# EAGLE design Lux_5V Compatable (EAGLE 8.1.1)
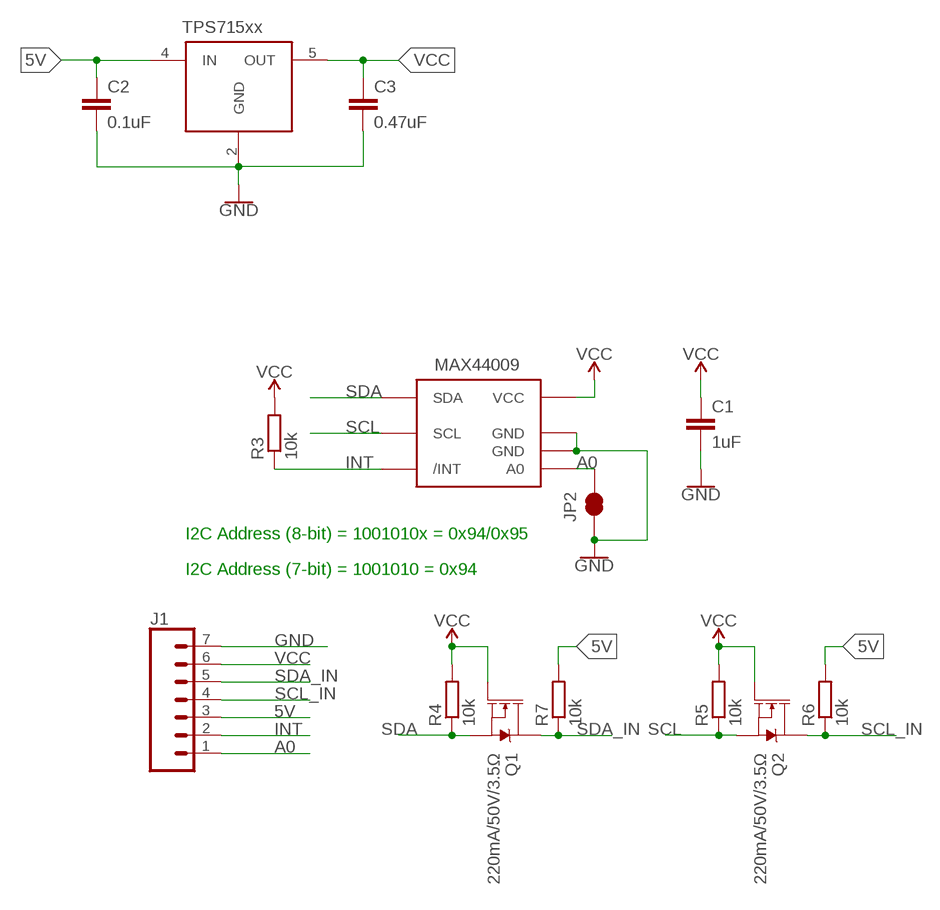
[diagram p0: schematic, sheet 1]

## Parts
C1  1uF  C-EUC0603  [C0603]
C2  0.1uF  C-EUC0603  [C0603]
C3  0.47uF  C-EUC0603  [C0603]
J1  CONN_07  [1X07]
JP2  JUMPER-SMT_2_NC_TRACE_SILK  [SMT-JUMPER_2_NC_TRACE_SILK]
Q1  220mA/50V/3.5Ω  MOSFET-NCH-BSS138  [SOT23-3]
Q2  220mA/50V/3.5Ω  MOSFET-NCH-BSS138  [SOT23-3]
R3  10k  R-EU_R0603  [R0603]
R4  10k  R-EU_R0603  [R0603]
R5  10k  R-EU_R0603  [R0603]
R6  10k  R-EU_R0603  [R0603]
R7  10k  R-EU_R0603  [R0603]
U$1  MAX44009  [UTDFN6]
U$2  TPS715XX  [DCK_R-PDSO-G5]

## Nets
5V: C2.1 J1.3 R6.2 R7.2 U$2.4(IN)
A0: J1.1 JP2.2 U$1.P$3(A0)
GND: C1.2 C2.2 C3.2 J1.7 JP2.1 U$1.P$2(GND) U$1.P$7(GND) U$2.2(GND)
INT: J1.2 R3.1 U$1.P$4(/INT)
SCL: Q2.2(S) R5.1 U$1.P$5(SCL)
SCL_IN: J1.4 Q2.3(D) R6.1
SDA: Q1.2(S) R4.1 U$1.P$6(SDA)
SDA_IN: J1.5 Q1.3(D) R7.1
VCC: C1.1 C3.1 J1.6 Q1.1(G) Q2.1(G) R3.2 R4.2 R5.2 U$1.P$1(VCC) U$2.5(OUT)

## Notes on the sheet
- I2C Address (8-bit) = 1001010x = 0x94/0x95
- I2C Address (7-bit) = 1001010 = 0x94

## Library data of the parts
C1-C3 = rcl:C-EU: CAPACITOR, European symbol
J1 = SparkFun-Connectors:CONN_07: Multi connection point. Often used as Generic Header-pin footprint for 0.1 inch spaced/style header connections On any of the 0.1 inch spaced packages, you can populate with these: Break Away Headers - Straight <https://www.sparkfun.com/products/116> (PRT-00116) Break Away Male Headers - Right Angle <https://www.sparkfun.com/products/553> (PRT-00553) Female Headers <https://www.sparkfun.com/products/115> (PRT-00115) Break Away Headers - Machine Pin <https://www.sparkfun.com/products/117> (PRT-00117) Break Away Female Headers - Swiss Machine Pin <https://www.sparkfun.com/products/743> (PRT-00743) For SCREWTERMINALS and SPRING TERMINALS visit here: Screw Terimnals on SparkFun.com <https://www.sparkfun.com/search/results?term=Screw+Terminals> (5mm/3.5mm/2.54mm spacing) This device is also useful as a general connection point to wire up your design to another part of your project. Our various solder wires solder well into these plated through hole pads. Hook-Up Wire - Assortment (Stranded, 22 AWG) <https://www.sparkfun.com/products/11375> (PRT-11375) Hook-Up Wire - Assortment (Solid Core, 22 AWG) <https://www.sparkfun.com/products/11367> (PRT-11367) View the entire wire category on our website here <https://www.sparkfun.com/categories/141> Special notes: Molex polarized connector foot print use with SKU : PRT-08231 with associated crimp pins and housings. 1MM SMD Version SKU: PRT-10208 NOTES ON THE VARIANTS LOCK and LOCK_LONGPADS... This footprint was designed to help hold the alignment of a through-hole component (i.e. 6-pin header) while soldering it into place. You may notice that each hole has been shifted either up or down by 0.005 of an inch from it's more standard position (which is a perfectly straight line). This slight alteration caused the pins (the squares in the middle) to touch the edges of the holes. Because they are alternating, it causes a "brace" to hold the component in place. 0.005 has proven to be the perfect amount of "off-center" position when using our standard breakaway headers. Although looks a little odd when you look at the bare footprint, once you have a header in there, the alteration is very hard to notice. Also,if you push a header all the way into place, it is covered up entirely on the bottom side.
JP2 = SparkFun-Jumpers:JUMPER-SMT_2_NC_TRACE: Normally closed trace jumper This jumper has a trace between two pads so it's normally closed (NC). Use a razor knife to open the connection. For best results follow the IPC guidelines for cutting traces: Cutout at least 0.063 mm (0.005 in). Remove all loose material to clean up the cut area. Seal the cut with an approved epoxy. Reapply solder to reclose the connection.
Q1 Q2 = SparkFun-DiscreteSemi:MOSFET-NCH: N-channel MOSFETs Voltage controlled devices that allow control of high current outputs. SparkFun Products: SparkFun OpenScale <https://www.sparkfun.com/products/13261> SparkFun Digital Sandbox <https://www.sparkfun.com/products/12651> SparkFun Monster Moto Shield <https://www.sparkfun.com/products/10182> SparkFun MOSFET Power Controller <https://www.sparkfun.com/products/11214>; PROD_ID: TRANS-00830
R3-R7 = rcl:R-EU_: RESISTOR, European symbol
U$1 = Custom:MAX44009: MAX44009, ambient light sensor with I2C interface and configurable interrupt, 3.3v device
U$2 = Custom:TPS715XX: Linear voltage regulator, Vin up to 24V, output current 50 mA

## Board
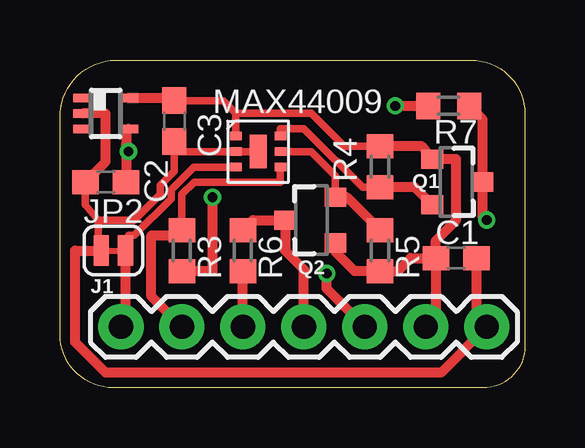
[diagram p1: board, top side]
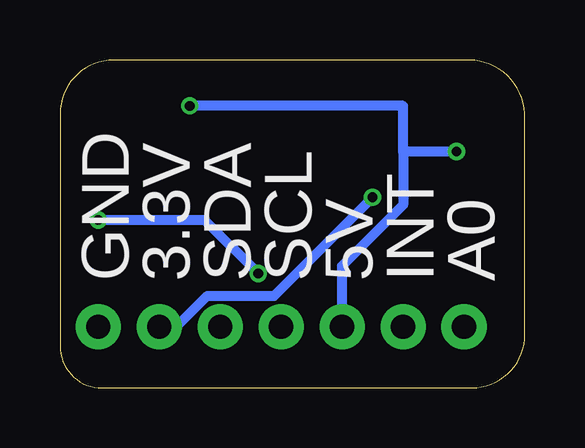
[diagram p2: board, bottom side, seen from below]

Size 19.37 x 13.66 mm. Coordinates in mm from the lower left corner, seen from the top.
Outline: 0,2.22 0,11.43 arc-90 2.54,13.65 17.14,13.65 arc-90 19.37,11.43 19.37,1.91 arc-90 17.78,0 2.22,0 arc-90 0,2.22
Copper layers (1*16): Top 0.035mm / dielectric 1.5mm / Bottom 0.035mm
Design rules "PCB-POOL Standard": minimum track width 0.15mm, minimum drill 0.3mm, track to track 0.15mm, track to pad 0.15mm, pad to pad 0.15mm, via to via 0.15mm, smd to smd 0.15mm, copper to edge 0.3mm, drill to drill 0.2mm, minimum pad ring 0.2mm, minimum via ring 0.15mm, stop-mask expansion 0.075mm, vias tented up to drill 0mil, thermal gap 0.2mm

### Footprints (pad centres in the part's own frame; a part is rotated, then mirrored left to right if it is on the bottom)
C0603 = smd 1.1 x 1: 1 -0.85,0; 2 0.85,0
1X07 = drill 1.016 pad 1.88: 1 0,0; 2 2.54,0; 3 5.08,0; 4 7.62,0; 5 10.16,0; 6 12.7,0; 7 15.24,0
SMT-JUMPER_2_NC_TRACE_SILK = smd 0.635 x 1.27: 1 -0.508,0; 2 0.508,0
SOT23-3 = smd 0.8 x 0.9: 1 -0.95,-1; 2 0.95,-1; 3 0,1.1
R0603 = smd 1 x 1.1: 1 -0.85,0; 2 0.85,0
UTDFN6 = smd 0.48 x 0.36: P$1 -0.925,0.65; P$2 -0.925,0; P$3 -0.925,-0.65; P$4 0.925,-0.65; P$5 0.925,0; P$6 0.925,0.65 | smd 0.71 x 1.4: P$7 0,0
DCK_R-PDSO-G5 = smd 0.35 x 0.8: 1 -0.65,-0.95; 2 0,-0.95; 3 0.65,-0.95; 4 0.65,0.95; 5 -0.65,0.95

### Placement (x,y rotation side)
C1  16.51,5.4 0 top
C2  1.91,8.57 180 top
C3  4.76,11.11 270 top
J1  2.54,2.54 0 top
JP2  2.22,5.71 0 top
Q1  16.51,8.57 270 top
Q2  10.48,6.99 90 top
R3  5.08,5.71 270 top
R4  13.34,9.21 90 top
R5  13.34,5.71 270 top
R6  7.62,5.71 270 top
R7  16.19,11.75 180 top
U$1  8.26,9.84 0 top
U$2  1.91,11.43 270 top

### Tracks (layer width: path | path; a pad name or v marks a point on that pad's centre or on a via)
5V  (via drill 0.4)
  Top 0.406: U$2.4 2.75,10.68 2.75,10.16 2.75,9.95 | 2.75,9.95 C2.1 | J1.3 R6.2 | v13.97,11.75 R7.2 | 2.75,9.95 v2.86,9.84
  Bottom 0.406: J1.3 7.62,5.08 5.08,7.62 5.08,9.84 | 5.08,9.84 5.08,11.75 v13.97,11.75 | v2.86,9.84 5.08,9.84
A0
  Top 0.305: U$1.P$3 5.57,9.19 4.62,8.24 4.62,7.88 3.1,6.35 2.86,6.35 2.86,5.71 JP2.2
  Top 0.406: J1.1 2.73,2.67 JP2.2
GND
  Top 0.305: U$1.P$7 U$1.P$2 4.76,9.84 | 1.59,5.91 JP2.1 1.59,6.35 1.59,6.99 | 1.59,6.99 3.09,6.99 4.17,8.07 4.17,8.43 4.76,9.03 4.76,9.84 | 4.76,9.84 C3.2 | 1.59,6.99 1.05,7.62 C2.2
  Top 0.406: JP2.1 0.64,5.71 0.64,1.91 1.91,0.64 15.88,0.64 J1.7 17.36,2.96 C1.2 | C2.2 1.91,9.42 1.91,11.43 U$2.2
INT
  Top 0.305: U$1.P$4 9.18,8.57 5.6,8.57 5.08,8.06 R3.1
  Top 0.406: J1.2 3.81,3.81 3.81,6.35 4.87,6.35 arc90 R3.1
SCL
  Top 0.305: U$1.P$5 10.48,9.84 11.48,8.84 Q2.2
  Top 0.406: 13.23,6.67 R5.1 11.96,7.93 Q2.2
SCL_IN
  Top 0.406: J1.4 10.16,4.93 9.38,5.71 Q2.3 8.04,6.99 R6.1
SDA
  Top 0.305: R4.1 12.61,8.36 10.35,10.62 10.34,10.62 10.16,10.79 9.18,10.79 U$1.P$6
  Top 0.406: Q1.2 14.78,8.36 R4.1
SDA_IN  (via drill 0.4)
  Top 0.406: R7.1 17.61,11.18 Q1.3 17.61,7.16 v17.78,6.99 | J1.5 11.11,4.13 v11.11,4.76
  Bottom 0.406: v11.11,4.76 13.34,6.99 v17.78,6.99
VCC  (via drill 0.4)
  Top 0.305: 7.33,11.43 10.48,11.43 11.85,10.06 R4.2 | 7.33,11.43 U$1.P$1 | 7.33,11.43 6.8,11.96 C3.1
  Top 0.406: 13.23,4.76 R5.2 | J1.6 15.66,2.96 C1.1 | R4.2 15.09,10.06 Q1.1 16.51,9.52 16.51,6.99 15.66,6.13 C1.1 | R5.2 14.07,4.87 14.61,5.4 C1.1 | R3.2 6.35,4.87 v6.35,7.94 | R5.2 12.28,4.87 11.48,5.67 Q2.1 | 4.56,11.76 C3.1 arc90 4.64,12.08 U$2.5
  Bottom 0.406: v6.35,7.94 10.45,3.83 13.24,3.83 14.53,2.54 J1.6

### Text on the board
_tsilk: MAX44009
_bsilk: A0 | INT | 5V | SCL | SDA | 3.3V | GND